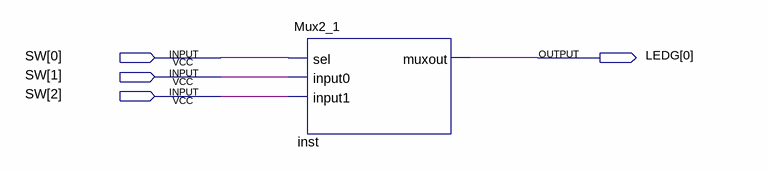
[diagram p0: schematic sheet]
// Quartus schematic Mux2_1Demo.bdf as structural Verilog: 1 symbols, 4 pins
module Mux2_1Demo (
  input  [2:0] SW,
  output [0:0] LEDG
);

  Mux2_1 inst (.sel(SW[0]), .input0(SW[1]), .input1(SW[2]), .muxout(LEDG[0]));
endmodule
